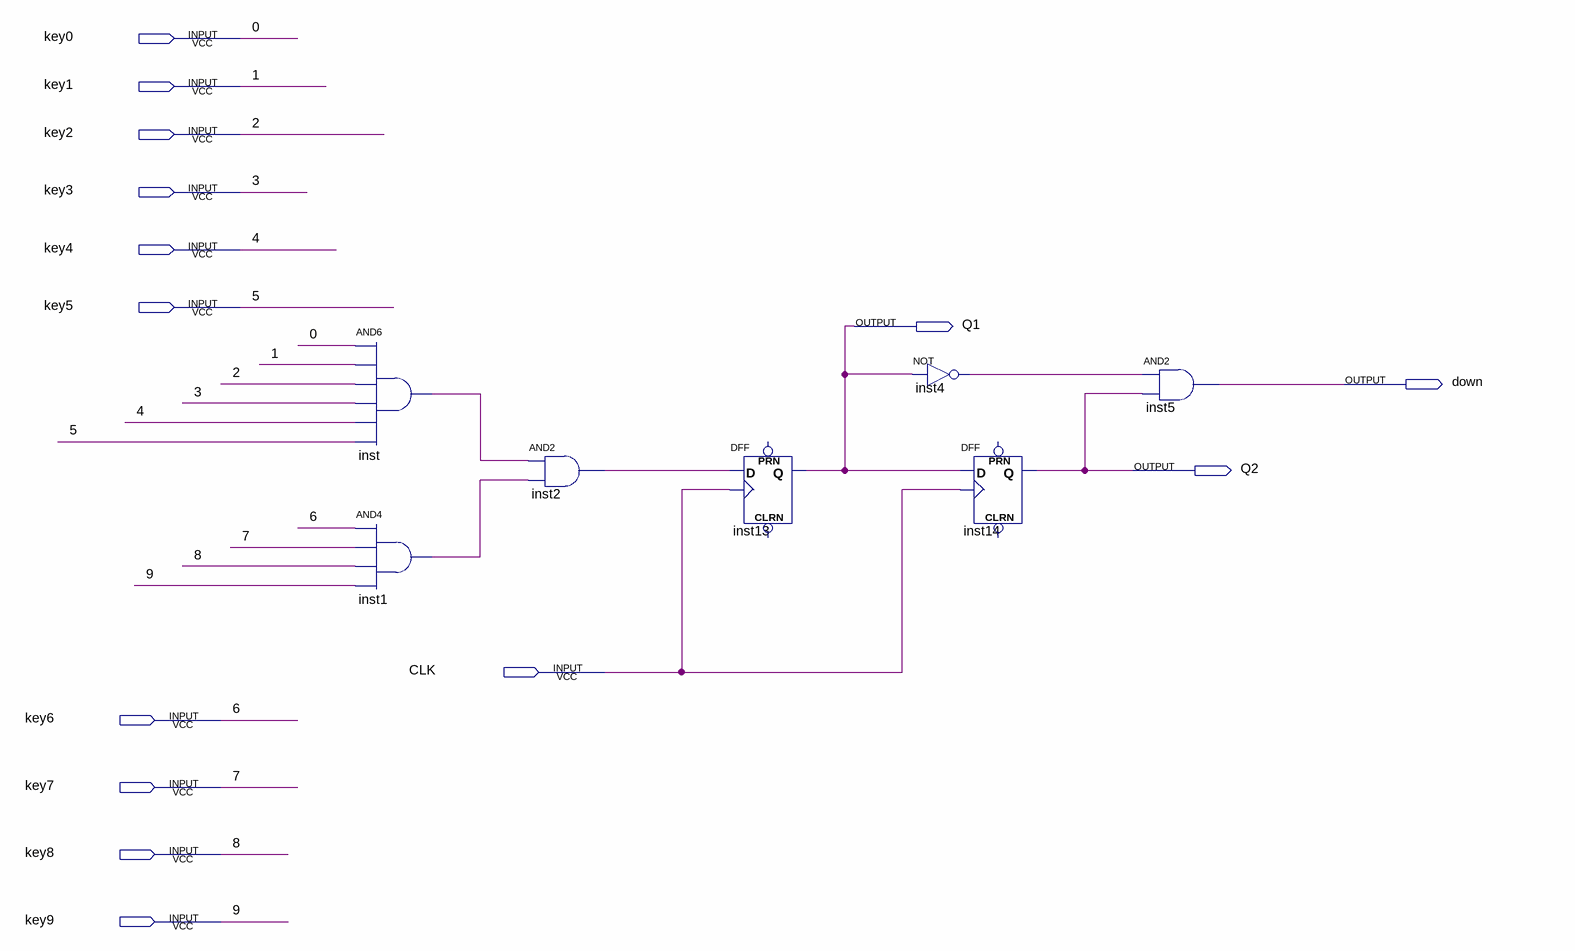
[diagram p0: schematic sheet]
// Quartus schematic downEdge.bdf as structural Verilog: 7 symbols, 14 pins
module downEdge (
  input  key0,
  input  key1,
  input  key2,
  input  key3,
  input  key4,
  input  key5,
  input  CLK,
  input  key6,
  input  key7,
  input  key8,
  input  key9,
  output Q1,
  output down,
  output Q2
);

  wire inst1_out, inst2_out, inst4_out, inst_out;

  and inst (inst_out, key0, key1, key2, key3, key4, key5);
  and inst1 (inst1_out, key6, key7, key8, key9);
  and inst2 (inst2_out, inst_out, inst1_out);
  DFF inst13 (.CLK(CLK), .D(inst2_out), .Q(Q1));  // open: CLRN, PRN
  not inst4 (inst4_out, Q1);
  DFF inst14 (.CLK(CLK), .D(Q1), .Q(Q2));  // open: CLRN, PRN
  and inst5 (down, inst4_out, Q2);

  // Other names for the same wires on the sheet: 0 = key0; 1 = key1; 2 = key2; 3 = key3; 4 = key4; 5 = key5; 6 = key6;
  //   7 = key7; 8 = key8; 9 = key9
endmodule
